# Altium schematic sheet Headers.SchDoc
size A4; SheetNumber: 6; SheetTotal: 12
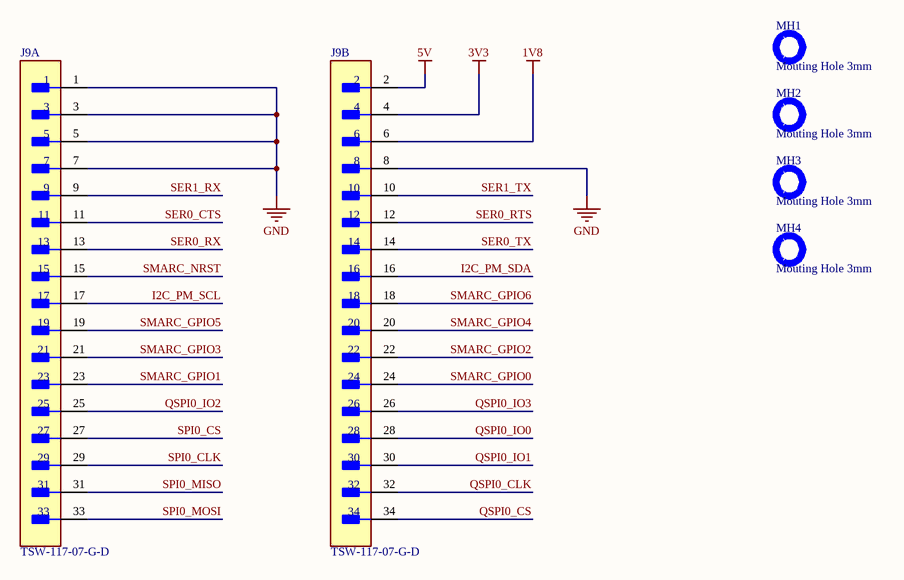
[diagram p0: Headers.SchDoc]

## Parts
J9  TSW-117-07-G-D  [FP-TSW-117-07-G-D-MFG]  (parts A,B of 2)
MH1  Mouting Hole 3mm  [MH3]
MH2  Mouting Hole 3mm  [MH3]
MH3  Mouting Hole 3mm  [MH3]
MH4  Mouting Hole 3mm  [MH3]

## Nets
1V8: J9.6
3V3: J9.4
5V: J9.2
GND: J9.1 J9.3 J9.5 J9.7 J9.8
I2C_PM_SCL: J9.17
I2C_PM_SDA: J9.16
QSPI0_CLK: J9.32
QSPI0_CS: J9.34
QSPI0_IO0: J9.28
QSPI0_IO1: J9.30
QSPI0_IO2: J9.25
QSPI0_IO3: J9.26
SER0_CTS: J9.11
SER0_RTS: J9.12
SER0_RX: J9.13
SER0_TX: J9.14
SER1_RX: J9.9
SER1_TX: J9.10
SMARC_GPIO0: J9.24
SMARC_GPIO1: J9.23
SMARC_GPIO2: J9.22
SMARC_GPIO3: J9.21
SMARC_GPIO4: J9.20
SMARC_GPIO5: J9.19
SMARC_GPIO6: J9.18
SMARC_NRST: J9.15
SPI0_CLK: J9.29
SPI0_CS: J9.27
SPI0_MISO: J9.31
SPI0_MOSI: J9.33

## Library data of the parts
J9 = CMP-02766-000015-1: CONN HEADER VERT 34POS 2.54MM; Manufacturer: Samtec; Current Rating: 6.3A; Voltage Rating: 550V; Conn Orientation: Vertical; Conn Gender: Male; Number Of Contacts: 34; RoHS: TRUE; Temperature Range High: +125°C; Digikey Description: CONN HEADER VERT 34POS 2.54MM; Manufacturer Part Number: TSW-117-07-G-D; ComponentLink2Description: Datasheet; Device Class L1: Connectors; Automotive: No; Height: 8.71mm; Device Class L3: unset; Lead Free: No; Number Of Rows: 2; Temperature: -55°C to +125°C; Pitch: 2.54mm; Octopart: https://octopart.com/tsw-117-07-g-d-samtec-272162; ComponentLink2URL: http://suddendocs.samtec.com/prints/tsw-xxx-xx-xxx-x-xx-xxx-mkt.pdf; Temperature Range Low: -55°C; Footprint Url: http://suddendocs.samtec.com/prints/tsw-xxx-xx-x-x-xx-xxx-footprint.pdf; Device Class L2: Headers and Wire Housings; Package: TSW-117-07-G-D; Contact Material: Gold,Nickel; Category: Conn
MH1-MH4 = MH3